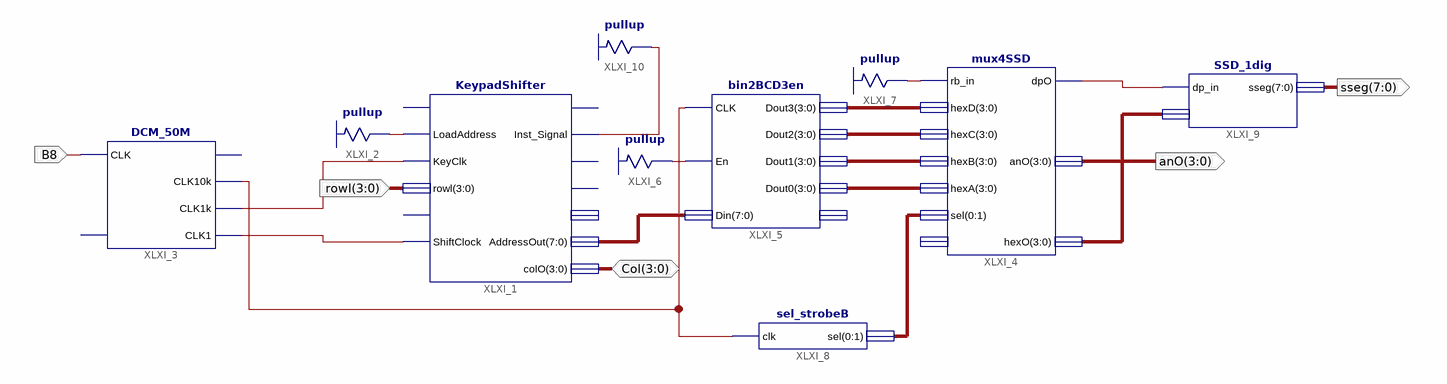
[diagram p0: schematic sheet 1]
// Xilinx ISE schematic topleveltesting.sch (spartan3e) as structural Verilog: 10 symbols, 5 ports
module topleveltesting (
  input  [3:0] rowI,
  input  B8,
  inout  [3:0] Col,
  output [3:0] anO,
  output [7:0] sseg
);

  wire XLXN_1, XLXN_3, XLXN_4, XLXN_7, XLXN_9, XLXN_15, XLXN_18, XLXN_23;
  wire [1:0] XLXN_17;
  wire [3:0] XLXN_11, XLXN_12, XLXN_13, XLXN_14, XLXN_19;
  wire [7:0] XLXN_10;

  KeypadShifter XLXI_1 (
    .LoadAddress(XLXN_1), .KeyClk(XLXN_3), .rowl(rowI), .ShiftClock(XLXN_4), .Inst_Signal(XLXN_23),
    .AddressOut(XLXN_10), .colO(Col));  // open: LoadData, DorI, KeyL, Data_Signal, Load_Addr_Signal, DataOut
  \pullup  XLXI_2 (.O(XLXN_1));
  DCM_50M XLXI_3 (.CLK(B8), .CLK10k(XLXN_7), .CLK1k(XLXN_3), .CLK1(XLXN_4));  // open: RST, CLK1M
  mux4SSD XLXI_4 (
    .rb_in(XLXN_15), .hexD(XLXN_14), .hexC(XLXN_13), .hexB(XLXN_12), .hexA(XLXN_11),
    .sel({XLXN_17[0], XLXN_17[1]}), .dpO(XLXN_18), .anO(anO), .hexO(XLXN_19));  // open: dp_in
  bin2BCD3en XLXI_5 (
    .CLK(XLXN_7), .En(XLXN_9), .Din(XLXN_10), .Dout3(XLXN_14), .Dout2(XLXN_13), .Dout1(XLXN_12),
    .Dout0(XLXN_11));  // open: RBout
  \pullup  XLXI_6 (.O(XLXN_9));
  \pullup  XLXI_7 (.O(XLXN_15));
  sel_strobeB XLXI_8 (.clk(XLXN_7), .sel({XLXN_17[0], XLXN_17[1]}));
  SSD_1dig XLXI_9 (.dp_in(XLXN_18), .sseg(sseg));  // open: hexD
  \pullup  XLXI_10 (.O(XLXN_23));
endmodule
